# Altium schematic sheet Temp Sensor Unit.SchDoc
size A4; SheetNumber: 7; SheetTotal: 8
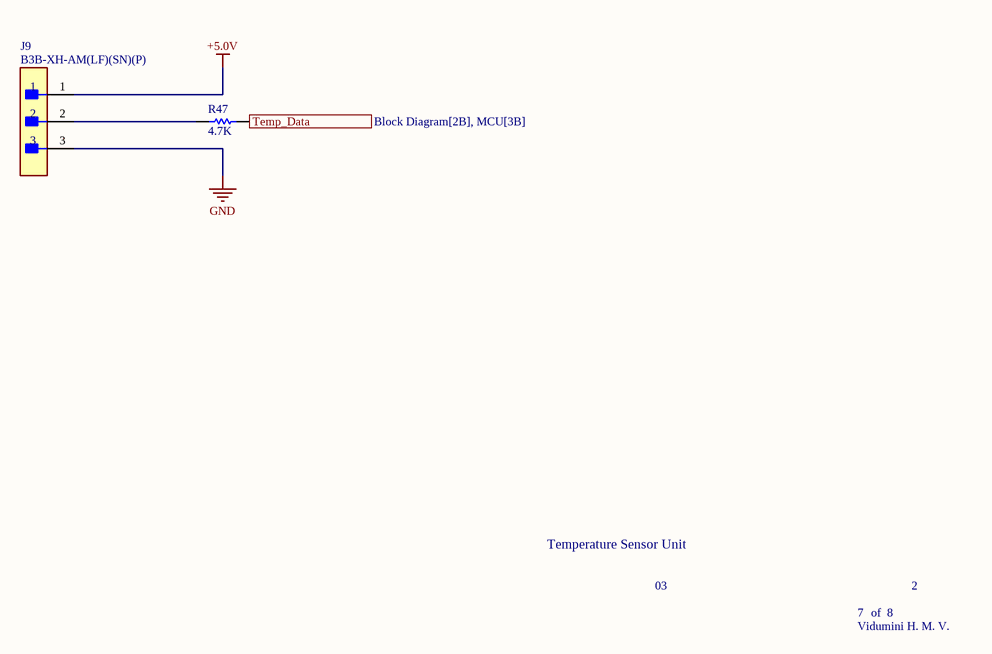
[diagram p0: Temp Sensor Unit.SchDoc]

## Parts
J9  B3B-XH-AM(LF)(SN)(P)  [FP-B3B-XH-AM_LF_SN_P-MFG]
R47  4.7K  [RESC3216X60X45ML15T20]

## Ports
Temp_Data (out, see Block Diagram[2B], MCU[3B])

## Nets
+5.0V: J9.1
GND: J9.3
Temp_Data: R47.1 ; port Temp_Data
NetJ9_2: J9.2 R47.2

## Notes on the sheet
- Temperature Sensor Unit
- 03
- 7
- of  8
- 2
- Vidumini H. M. V.

## Library data of the parts
J9 = CMP-17439-000213-1: CONN HEADER VERT 3POS 2.5MM; Number of Positions: 3; Connector Type: Male Pin; Pitch: 0.098inch; Package Quantity: 1000; Series: XH; Termination: Press-Fit; Contact Type: Male Pin; Color: Natural; Packaging: Bulk; Contact Plating: Tin; Mount: Through Hole; Number of Rows: 1
R47 = CMP-2100-03618-1: Chip Resistor, 4.7 KOhm, +/- 1%, 0.25 W, -55 to 155 degC, 1206 (3216 Metric), RoHS, Tape and Reel; Manufacturer: Vishay Semiconductor; Power Rating: 250mW; Voltage Rating: 200V; Temperature Coefficient: 100ppm/degreesC; Package Quantity: 10; Composition: ThickFilm; REACH SVHC: Unknown; Mount: SurfaceMount; Max Operating Temperature: 155degC; Length: 3.2mm; Number of Terminations: 2; Case Code (Metric): 3216; Military Standard: Not; Width: 1.6mm; Datasheet Version: 41061.0; Max Power Dissipation: 250mW; Datasheet URL: http://www.vishay.com/docs/20035/dcrcwe3.pdf; Contact Plating: Tin; Case/Package: 1206; Height: 0.55mm; Package Reference: 1206.0; Lead Free: LeadFree; Weight: 0.000353oz; Package Description: 2-Pin Surface Mount Device, Body 3.15 x 1.6 mm; Min Operating Temperature: -55degC; Resistance: 4.7KOhm; Packaging: TapeandReel; Depth: 1.6mm; Tolerance: 1%; RoHSCompliant: true; Termination: SMD/SMT; Case Code (Imperial): 1206; Voltage Rating (DC): 200V; Radiation Hardening: No; Manufacturer URL: http://www.vishay.com/